# Altium schematic sheet Antenna Switch.SchDoc
size A4; SheetNumber: 5; SheetTotal: 10
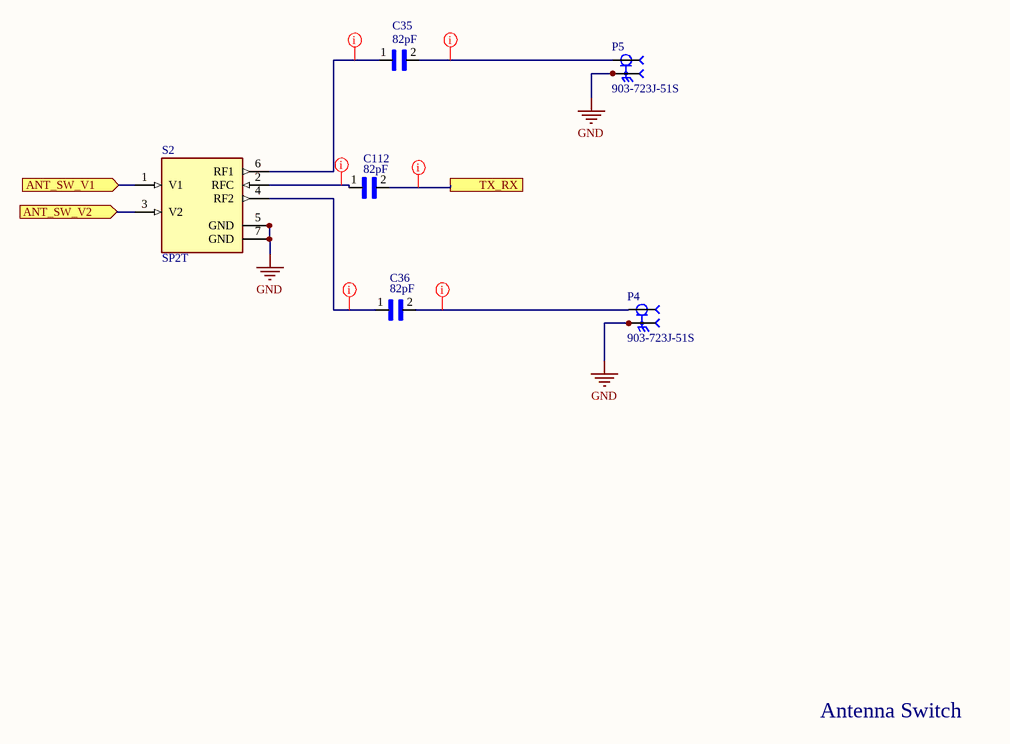
[diagram p0: Antenna Switch.SchDoc]

## Parts
C35  82pF  [CAPC1005X55N]
C36  82pF  [CAPC1005X55N]
C112  82pF  [CAPC1005X55N]
P4  903-723J-51S  [AMPHENOL_903-723J-51S]
P5  903-723J-51S  [AMPHENOL_903-723J-51S]
S2  SP2T  [SW_SKY13431-374LF]

## Ports
ANT_SW_V1 (in, see System Overview[4A], External interfaces and connections[3D], Microcontroller[1C]), ANT_SW_V2 (in, see System Overview[4A], External interfaces and connections[3D], Microcontroller[1C]), TX_RX (see System Overview[4A], Carrier Cancellation Circuit[1B])

## Nets
GND: P4.S1(SHIELD) P4.S2(SHIELD) P4.S3(SHIELD) P4.S4(SHIELD) P4.S5(SHIELD) P4.S6(SHIELD) P4.S7(SHIELD) P4.S8(SHIELD) P5.S1(SHIELD) P5.S2(SHIELD) P5.S3(SHIELD) P5.S4(SHIELD) P5.S5(SHIELD) P5.S6(SHIELD) P5.S7(SHIELD) P5.S8(SHIELD) S2.5(GND) S2.7(GND)
ANT_SW_V1: S2.1(V1) ; port ANT_SW_V1
ANT_SW_V2: S2.3(V2) ; port ANT_SW_V2
TX_RX: C112.2 ; port TX_RX
NetC35_1: C35.1 S2.6(RF1)
NetC35_2: C35.2 P5.1(SIG)
NetC36_1: C36.1 S2.4(RF2)
NetC36_2: C36.2 P4.1(SIG)
NetC112_1: C112.1 S2.2(RFC)

## Layout directives
net class RF_50: NetC35_1, NetC35_2, NetC36_1, NetC36_2, NetC112_1, TX_RX

## Notes on the sheet
- Antenna Switch

## Library data of the parts
C35 C36 C112 = GRM1555C1H820GA01J: CAP CER 82PF 50V C0G/NP0 0402; Package: None; Price: None; Value: *; MP: GRM1555C1H820GA01J; Availability: Unavailable
P4 P5 = 903-723J-51S: SMB Connector Jack, Male Pin 50Ohm Board Edge, End Launch Solder; Package: None; Price: None; Value: *; MP: 903-723J-51S; Availability: Unavailable
S2 = SKY13431-374LF: RF Switch IC WiMax, WLAN SPDT 6GHz 50Ohm 6-DFN (1.5x1.5); MF: Skyworks Solutions; Package: XFDFN-6 Skyworks Solutions; MP: SKY13431-374LF; Purchase-URL: https://pricing.snapeda.com/search/part/SKY13431-374LF/?ref=eda; Value: *; SnapEDA_Link: https://www.snapeda.com/parts/SKY13431-374LF/Skyworks%20Solutions%20Inc./view-part/1233094/?ref=snap; Availability: Warning; Price: None